# Altium schematic sheet Sheet1.SchDoc
size A; SheetNumber: 1; SheetTotal: 1; SPICEModelCacheBOABPEOK: <root> / <DocumentId>BOABPEOK</DocumentId> / </root>
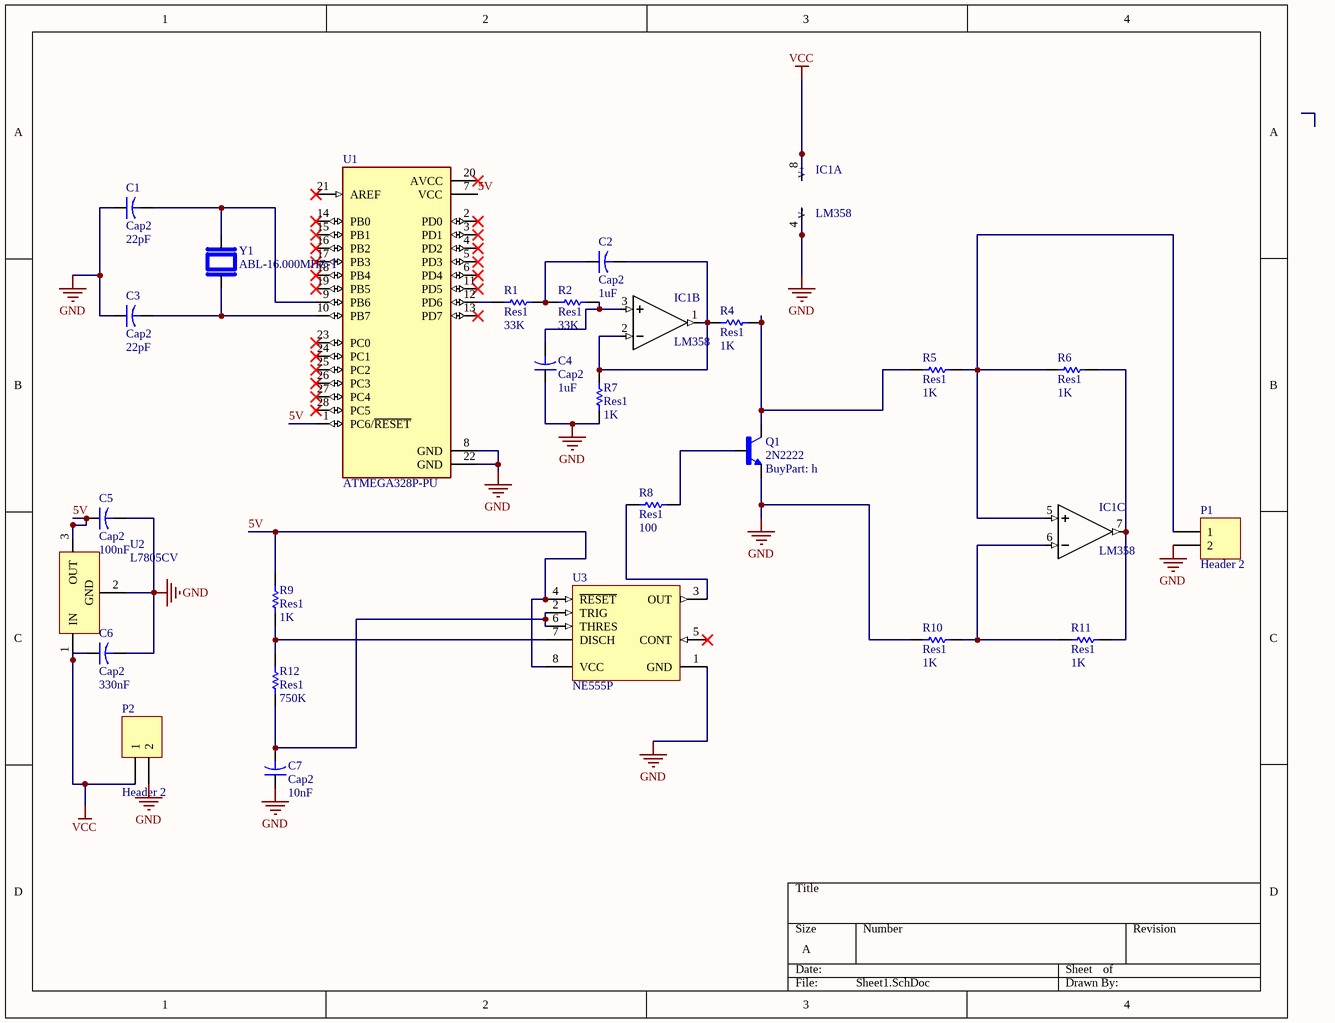
[diagram p0: Sheet1.SchDoc]

## Parts
C1  Cap2  value 22pF  [CAPR5-4X5]
C2  Cap2  value 1uF  [CAPR5-4X5]
C3  Cap2  value 22pF  [CAPR5-4X5]
C4  Cap2  value 1uF  [CAPR5-4X5]
C5  Cap2  value 100nF  [CAPR5-4X5]
C6  Cap2  value 330nF  [CAPR5-4X5]
C7  Cap2  value 10nF  [CAPR5-4X5]
IC1  LM358  [*DIL08]  (parts A,B,C of 3)
P1  Header 2  [HDR1X2]
P2  Header 2  [HDR1X2]
Q1  2N2222  BuyPart: h  [TO127P584H533-3]
R1  Res1  value 33K  [AXIAL-0.3]
R2  Res1  value 33K  [AXIAL-0.3]
R4  Res1  value 1K  [AXIAL-0.3]
R5  Res1  value 1K  [AXIAL-0.3]
R6  Res1  value 1K  [AXIAL-0.3]
R7  Res1  value 1K  [AXIAL-0.3]
R8  Res1  value 100  [AXIAL-0.3]
R9  Res1  value 1K  [AXIAL-0.3]
R10  Res1  value 1K  [AXIAL-0.3]
R11  Res1  value 1K  [AXIAL-0.3]
R12  Res1  value 750K  [AXIAL-0.3]
U1  ATMEGA328P-PU  [DIP794W46P254L2967H457Q28B]
U2  L7805CV  [TO220]
U3  NE555P  [P0008A]
Y1  ABL-16.000MHZ-T  [XTAL_HC49P488W46L1150T500H350]

## Nets
GND: C1.1 C3.1 C4.1 C5.2 C6.2 C7.1 IC1.4(V-) P1.2 P2.2 Q1.1(E) R7.1 R10.1 U1.8(GND) U1.22(GND) U2.2(GND) U3.1(GND)
VCC: C6.1 IC1.8(V+) P2.1 U2.1(IN)
5V: C5.1 R9.2 U1.1(PC6/~{RESET}) U1.7(VCC) U2.3(OUT) U3.4(~{RESET}) U3.8(VCC)
NetC1_2: C1.2 U1.9(PB6) Y1.2
NetC2_1: C2.1 R1.2 R2.1
NetC2_2: C2.2 IC1.1(OUT) IC1.2(-IN) R4.1 R7.2
NetC3_2: C3.2 U1.10(PB7) Y1.1
NetC4_2: C4.2 IC1.3(+IN) R2.2
NetC7_2: C7.2 R12.1 U3.2(TRIG) U3.6(THRES)
NetIC1_5: IC1.5(+IN) P1.1 R5.2 R6.1
NetIC1_6: IC1.6(-IN) R10.2 R11.1
NetIC1_7: IC1.7(OUT) R6.2 R11.2
NetQ1_2: Q1.2(B) R8.2
NetQ1_3: Q1.3(C) R4.2 R5.1
NetR1_1: R1.1 U1.12(PD6)
NetR8_1: R8.1 U3.3(OUT)
NetR9_1: R9.1 R12.2 U3.7(DISCH)

Not connected (* = marked no-connect by the designer): U1 2(PD0)* 3(PD1)* 4(PD2)* 5(PD3)* 6(PD4)* 11(PD5)* 13(PD7)* 14(PB0)* 15(PB1)* 16(PB2)* 17(PB3)* 18(PB4)* 19(PB5)* 20(AVCC)* 21(AREF)* 23(PC0)* 24(PC1)* 25(PC2)* 26(PC3)* 27(PC4)* 28(PC5)*; U3 5(CONT)*

## Library data of the parts
C1-C7 = Cap2: Capacitor; Published: 23-Sep-2002; PackageReference: CAPR5-4X5; Publisher: Altium Limited; PackageDescription: Capacitor; 2 Leads
IC1 = LM358: Op Amp Dual Low Power Amplifier Â±16V/32V 8-Pin TO-99 Tube; MF: Texas Instruments; Price: None; MP: LM358; SnapEDA_Link: https://www.snapeda.com/parts/LM358/Texas+Instruments/view-part/?ref=snap; Availability: In Stock; Purchase-URL: https://pricing.snapeda.com/search/part/LM358/?ref=eda; Check_prices: https://www.snapeda.com/parts/LM358/Texas+Instruments/view-part/?ref=eda; Package: None; Value: *
P1 P2 = Header 2: Header, 2-Pin; LatestRevisionDate: 17-Jul-2002; LatestRevisionNote: Re-released for DXP Platform.; Publisher: Altium Limited
Q1 = 2N2222: Bipolar (BJT) Transistor NPN 50V 800mA 500mW Through Hole TO-18 (TO-206AA); MF: ON Semiconductor; Package: TO-18 Texas Instruments; MP: 2N2222; Value: *; SnapEDA_Link: https://www.snapeda.com/parts/2N2222/ON%20Semiconductor/view-part/884681/?ref=snap; Price: None; Availability: Bad
R1 R2 R4-R12 = Res1: Resistor; Published: 8-Jun-2000; LatestRevisionDate: 17-Jul-2002; LatestRevisionNote: Re-released for DXP Platform.; PackageReference: AXIAL-0.3; Publisher: Altium Limited; PackageDescription: Axial Device, Thru-Hole; 2 Leads; 0.3 in Pin Spacing
U1 = ATMEGA328P-PU: ATmega Series 20 MHz 32 KB Flash 2 KB SRAM 8-Bit Microcontroller - DIP-28; Value: *; MP: ATMEGA328P-PU; Package: None; Availability: Unavailable; Price: None
U2 = CMP-0244-00483-1: Positive Voltage Regulator, 5V, 3-Pin TO-220; PackageDescription: TO, Thru-Hole, Vertical, Heatsink Mounted; 3 In-Line Leads; Pitch 2.54 mm; ComponentLink2Description: Datasheet; PackageReference: TO220; ComponentLink3URL: http://www.st.com/internet/com/TECHNICAL_RESOURCES/TECHNICAL_LITERATURE/PACKAGE_INFORMATION/CD00004649.pdf; DatasheetVersion: 16/11/2011; ComponentLink1Description: Manufacturer URL; ComponentLink1URL: http://www.st.com; PackageVersion: ver3.0; ComponentLink3Description: Package Specification; ComponentLink2URL: http://www.st.com/internet/com/TECHNICAL_RESOURCES/TECHNICAL_LITERATURE/DATASHEET/CD00000444.pdf
U3 = CMP-2000-04954-1: Precision Timer, 4.5 to 16 V, 0 to 70 degC, 8-Pin DIP, Pb-Free, Tube; Manufacturer: TexasInstruments; Maximum High Level Output Current: -200mA; Number of Internal Timers: 1; Operating Supply Voltage: 5; Maximum Low Level Output Current: 200mA; Rad Hard: No; Packaging: Rail/Tube; Manufacturer URL: http://www.ti.com/; Package Reference: P8; Package Description: 8-Pin Double In-line Package, Body 9.59 x 6.35 mm, Pitch 2.54 mm; Package URL: http://www.ti.com/lit/ml/mpdi001b/mpdi001b.pdf; Type: Standard; Datasheet URL: http://www.ti.com/general/docs/lit/getliterature.tsp?genericPartNumber=NE555&fileType=pdf; Category: Timer; Package: 8PDIP; Datasheet Version: Rev. I, 09/2014
Y1 = ABL-16.000MHZ-T: 16 MHz Â±10ppm Crystal 18pF 40 Ohms HC-49/US; MF: Abracon Corporation; Package: None; Purchase-URL: https://pricing.snapeda.com/search/part/ABL-16.000MHZ/?ref=eda; Value: *; Availability: In Stock; SnapEDA_Link: https://www.snapeda.com/parts/ABL-16.000MHZ/Abracon/view-part/?ref=snap; MP: ABL-16.000MHZ; Price: None; Check_prices: https://www.snapeda.com/parts/ABL-16.000MHZ/Abracon/view-part/?ref=eda